# Altium schematic sheet 06-multimodal-microcontroller.SchDoc
size A4; SheetNumber: 7; SheetTotal: 12
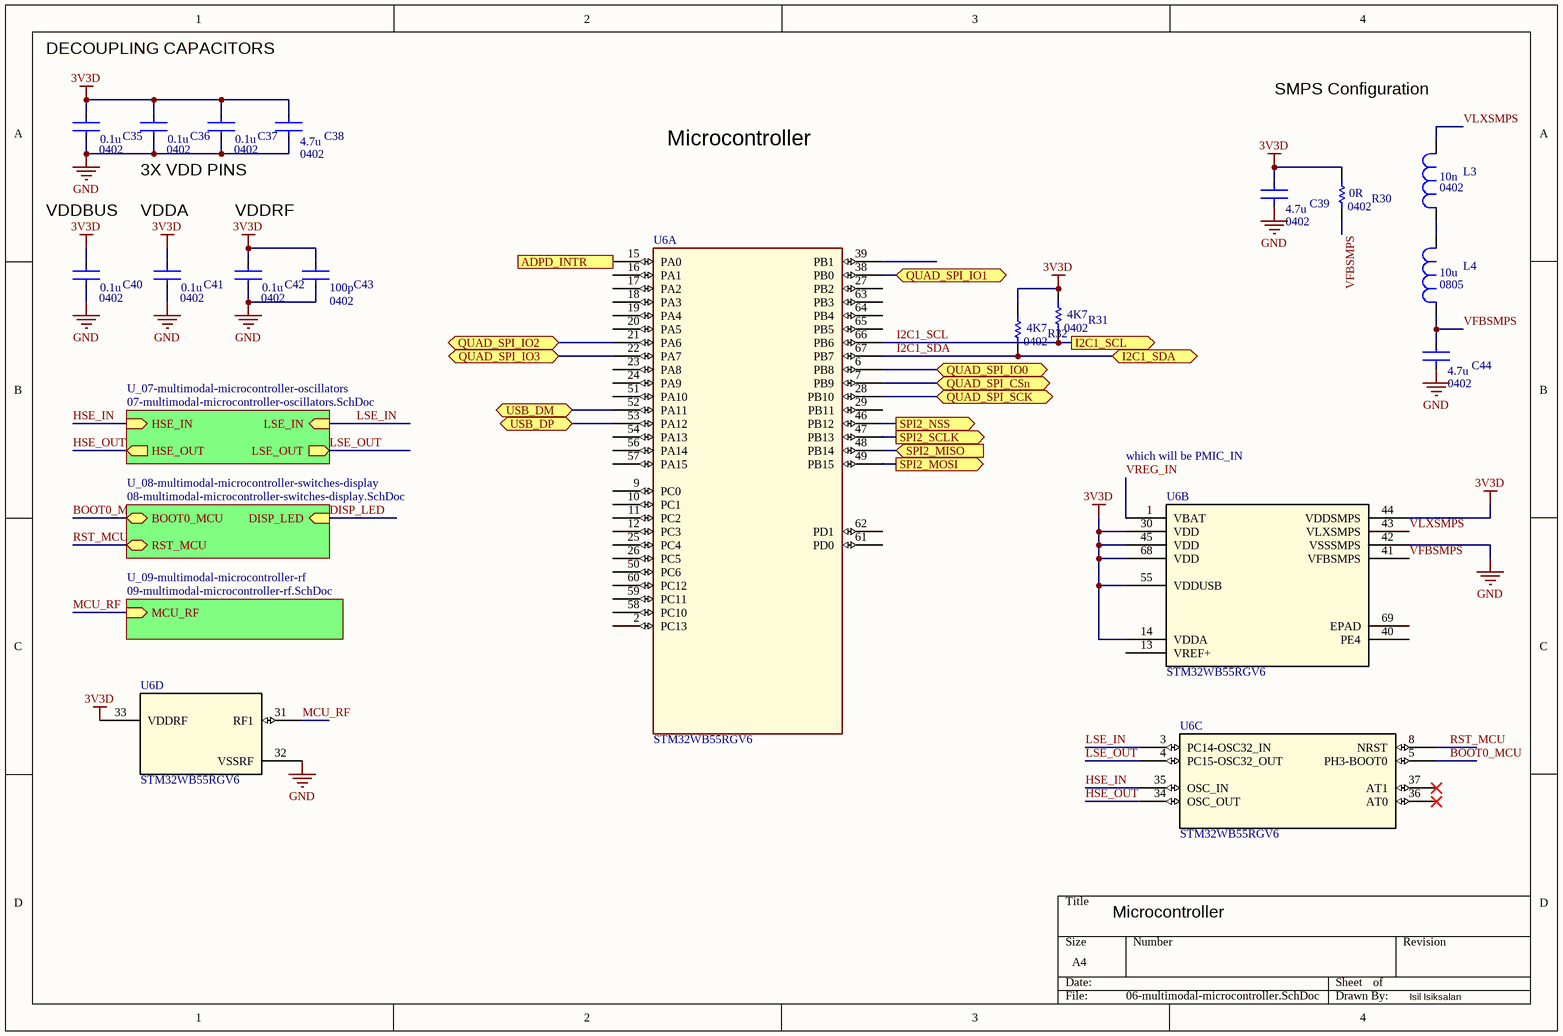
[diagram p0: 06-multimodal-microcontroller.SchDoc]

## Parts
C35  C1005X7R1H104K050BB  [CAPTDK0402]  (value not drawn)
C36  C1005X7R1H104K050BB  [CAPTDK0402]  (value not drawn)
C37  C1005X7R1H104K050BB  [CAPTDK0402]  (value not drawn)
C38  C1005X5R1A475K050BC  [CAPTDK0402]  (value not drawn)
C39  C1005X5R1A475K050BC  [CAPTDK0402]  (value not drawn)
C40  C1005X7R1H104K050BB  [CAPTDK0402]  (value not drawn)
C41  C1005X7R1H104K050BB  [CAPTDK0402]  (value not drawn)
C42  C1005X7R1H104K050BB  [CAPTDK0402]  (value not drawn)
C43  CGA2B2C0G1H101J050BA  [CAPTDK0402]  (value not drawn)
C44  C1005X5R1A475K050BC  [CAPTDK0402]  (value not drawn)
L3  LQG15WZ10NJ02D  [INDMURT0402]  (value not drawn)
L4  LQM21FN100N00L  [INDMURT0805]  (value not drawn)
R30  RMCF0402ZT0R00  [RES-STACK-POLE-0402]  (value not drawn)
R31  RMCF0402FT4K70  [RES-STACK-POLE-0402]  (value not drawn)
R32  RMCF0402FT4K70  [RES-STACK-POLE-0402]  (value not drawn)
U6  STM32WB55RGV6  [STM32WB55RG]  (parts A,B,C,D of 4)

## Sub-sheets
U_07-multimodal-microcontroller-oscillators = 07-multimodal-microcontroller-oscillators.SchDoc: LSE_IN (in), LSE_OUT (out), HSE_IN (in), HSE_OUT (out)
U_08-multimodal-microcontroller-switches-display = 08-multimodal-microcontroller-switches-display.SchDoc: BOOT0_MCU (bidir), RST_MCU (bidir), DISP_LED (in)
U_09-multimodal-microcontroller-rf = 09-multimodal-microcontroller-rf.SchDoc: MCU_RF (in)

## Ports
ADPD_INTR (out), I2C1_SCL (out), I2C1_SDA (bidir), QUAD_SPI_CSn (bidir), QUAD_SPI_IO0 (bidir), QUAD_SPI_IO1 (bidir), QUAD_SPI_IO2 (bidir), QUAD_SPI_IO3 (bidir), QUAD_SPI_SCK (bidir), SPI2_MISO (in), SPI2_MOSI (out), SPI2_NSS (out), SPI2_SCLK (out), USB_DM (bidir), USB_DP (bidir)

## Nets
3V3D: C35.1 C36.1 C37.1 C38.1 C39.1 C40.1 C41.1 C42.1 C43.1 R30.2 R31.2 R32.2 U6.14(VDDA) U6.30(VDD) U6.33(VDDRF) U6.44(VDDSMPS) U6.45(VDD) U6.55(VDDUSB) U6.68(VDD)
GND: C35.2 C36.2 C37.2 C38.2 C39.2 C40.2 C41.2 C42.2 C43.2 C44.2 U6.32(VSSRF) U6.42(VSSSMPS)
ADPD_INTR: U6.15(PA0) ; port ADPD_INTR
BOOT0_MCU: U6.5(PH3-BOOT0) ; sheet U_08-multimodal-microcontroller-switches-display/BOOT0_MCU
DISP_LED: sheet U_08-multimodal-microcontroller-switches-display/DISP_LED
HSE_IN: U6.35(OSC_IN) ; sheet U_07-multimodal-microcontroller-oscillators/HSE_IN
HSE_OUT: U6.34(OSC_OUT) ; sheet U_07-multimodal-microcontroller-oscillators/HSE_OUT
I2C1_SCL: R31.1 U6.66(PB6) ; port I2C1_SCL
I2C1_SDA: R32.1 U6.67(PB7) ; port I2C1_SDA
LSE_IN: U6.3(PC14-OSC32_IN) ; sheet U_07-multimodal-microcontroller-oscillators/LSE_IN
LSE_OUT: U6.4(PC15-OSC32_OUT) ; sheet U_07-multimodal-microcontroller-oscillators/LSE_OUT
MCU_RF: U6.31(RF1) ; sheet U_09-multimodal-microcontroller-rf/MCU_RF
QUAD_SPI_CSn: U6.7(PB9) ; port QUAD_SPI_CSn
QUAD_SPI_IO0: U6.6(PB8) ; port QUAD_SPI_IO0
QUAD_SPI_IO1: U6.38(PB0) ; port QUAD_SPI_IO1
QUAD_SPI_IO2: U6.21(PA6) ; port QUAD_SPI_IO2
QUAD_SPI_IO3: U6.22(PA7) ; port QUAD_SPI_IO3
QUAD_SPI_SCK: U6.28(PB10) ; port QUAD_SPI_SCK
RST_MCU: U6.8(NRST) ; sheet U_08-multimodal-microcontroller-switches-display/RST_MCU
SPI2_MISO: U6.48(PB14) ; port SPI2_MISO
SPI2_MOSI: U6.49(PB15) ; port SPI2_MOSI
SPI2_NSS: U6.46(PB12) ; port SPI2_NSS
SPI2_SCLK: U6.47(PB13) ; port SPI2_SCLK
USB_DM: U6.52(PA11) ; port USB_DM
USB_DP: U6.53(PA12) ; port USB_DP
VFBSMPS: C44.1 L4.2 R30.1 U6.41(VFBSMPS)
VLXSMPS: L3.1 U6.43(VLXSMPS)
VREG_IN: U6.1(VBAT)
NetL3_2: L3.2 L4.1

Not connected (* = marked no-connect by the designer): U6 2(PC13) 9(PC0) 10(PC1) 11(PC2) 12(PC3) 13(VREF+) 16(PA1) 17(PA2) 18(PA3) 19(PA4) 20(PA5) 23(PA8) 24(PA9) 25(PC4) 26(PC5) 27(PB2) 29(PB11) 36(AT0)* 37(AT1)* 39(PB1) 40(PE4) 50(PC6) 51(PA10) 54(PA13) 56(PA14) 57(PA15) 58(PC10) 59(PC11) 60(PC12) 61(PD0) 62(PD1) 63(PB3) 64(PB4) 65(PB5) 69(EPAD)

## Notes on the sheet
- DECOUPLING CAPACITORS
- SMPS Configuration
- 3X VDD PINS
- Microcontroller
- VDDBUS
- VDDA
- VDDRF
- which will be PMIC_IN
- Isil Isiksalan
- (in symbol C1005X5R1A475K050BC) 4.7u; 0402
- (in symbol C1005X7R1H104K050BB) 0.1u; 0402
- (in symbol CGA2B2C0G1H101J050BA_1) 100p; 0402
- (in symbol LQG15WZ10NJ02D) 10n; 0402
- (in symbol LQM21FN100N00L) 10u; 0805
- (in symbol RMCF0402FT4K70) 4K7; 0402
- (in symbol RMCF0402ZT0R00) 0R; 0402

## Library data of the parts
C35-C37 C40-C42 = C1005X7R1H104K050BB: CAP CER 0.1UF 50V X7R 0402; Supplier 1: Digi-Key; Supplier Part Number 1: 445-5932-1-ND
C38 C39 C44 = C1005X5R1A475K050BC: CAP CER 4.7UF 10V X5R 0402; Supplier 1: Digi-Key; Supplier Part Number 1: 445-13820-1-ND
C43 = CGA2B2C0G1H101J050BA_1: CAP CER 100PF 50V C0G 0402; Supplier 1: Digi-Key; Supplier Part Number 1: 445-5596-1-ND
L3 = LQG15WZ10NJ02D: FIXED IND 10NH 500MA 190MOHM SMD; Supplier 1: Digi-Key; Supplier Part Number 1: 490-15244-1-ND
L4 = LQM21FN100N00L: FIXED IND 10UH 60MA 650 MOHM SMD; Supplier 1: Digi-Key; Supplier Part Number 1: 490-1122-1-ND
R30 = RMCF0402ZT0R00: RES 0 OHM JUMPER 1/16W 0402; Supplier 1: Digi-Key; Supplier Part Number 1: RMCF0402ZT0R00CT-ND
R31 R32 = RMCF0402FT4K70: RES 4.7K OHM 1% 1/16W 0402; Supplier 1: Digi-Key; Supplier Part Number 1: RMCF0402FT4K70CT-ND
U6 = STM32WB55RGV6: Ultra-low-power dual core Arm Cortex-M4 MCU 64 MHz, Cortex-M0+ 32 MHz with 1 Mbyte of Flash memory, Bluetooth LE 5.4, 802.15.4, Zigbee, Thread, Matter, USB, LCD, AES-256; Manufacturer_Name: STMicroelectronics; Copyright: Copyright (C) 2025 Ultra Librarian. All rights reserved.; Manufacturer_Part_Number: STM32WB55RGV6; RefDes: RefDes; Type: Type